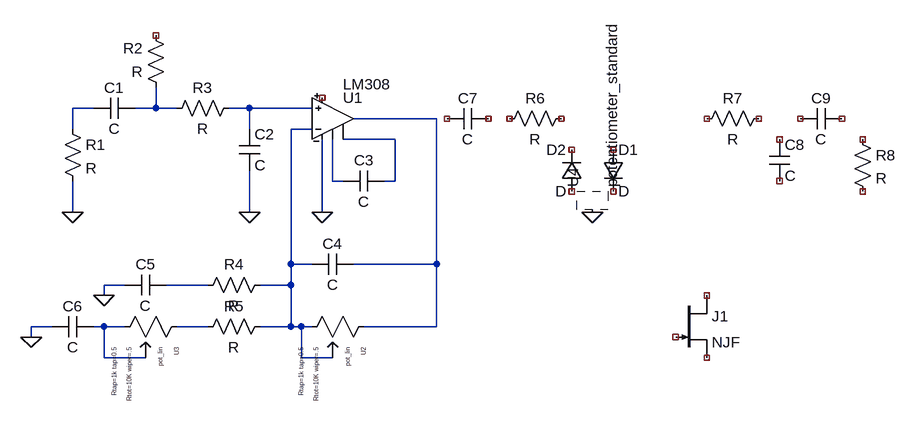
[diagram p0: schematic rat.asc]
rat.asc, the LTspice schematic file:
Version 4
SHEET 1 1336 724
WIRE 96 144 64 144
WIRE 192 144 192 112
WIRE 192 144 160 144
WIRE 224 144 192 144
WIRE 336 144 304 144
WIRE 432 144 336 144
WIRE 624 160 496 160
WIRE 64 176 64 144
WIRE 336 176 336 144
WIRE 432 176 400 176
WIRE 560 192 480 192
WIRE 464 256 464 192
WIRE 480 256 464 256
WIRE 560 256 560 192
WIRE 560 256 544 256
WIRE 64 304 64 256
WIRE 336 304 336 240
WIRE 448 304 448 192
WIRE 400 384 400 176
WIRE 432 384 400 384
WIRE 624 384 624 160
WIRE 624 384 496 384
WIRE 144 416 112 416
WIRE 272 416 208 416
WIRE 400 416 400 384
WIRE 400 416 352 416
WIRE 112 432 112 416
WIRE 32 480 0 480
WIRE 112 480 96 480
WIRE 144 480 112 480
WIRE 272 480 224 480
WIRE 400 480 400 416
WIRE 400 480 352 480
WIRE 416 480 400 480
WIRE 432 480 416 480
WIRE 624 480 624 384
WIRE 624 480 512 480
WIRE 0 496 0 480
WIRE 112 528 112 480
WIRE 176 528 112 528
WIRE 416 528 416 480
WIRE 464 528 416 528
FLAG 64 304 0
FLAG 336 304 0
FLAG 448 304 0
FLAG 112 432 0
FLAG 0 496 0
FLAG 864 304 0
SYMBOL res 48 160 R0
SYMATTR InstName R1
SYMBOL cap 160 128 R90
WINDOW 0 0 32 VBottom 2
WINDOW 3 32 32 VTop 2
SYMATTR InstName C1
SYMBOL res 208 128 R180
WINDOW 0 36 76 Left 2
WINDOW 3 36 40 Left 2
SYMATTR InstName R2
SYMBOL res 320 128 R90
WINDOW 0 0 56 VBottom 2
WINDOW 3 32 56 VTop 2
SYMATTR InstName R3
SYMBOL cap 320 176 R0
SYMATTR InstName C2
SYMBOL LM308 464 96 R0
SYMATTR InstName U1
SYMBOL cap 544 240 R90
WINDOW 0 0 32 VBottom 2
WINDOW 3 32 32 VTop 2
SYMATTR InstName C3
SYMBOL cap 496 368 R90
WINDOW 0 0 32 VBottom 2
WINDOW 3 32 32 VTop 2
SYMATTR InstName C4
SYMBOL potentiometer_standard 528 464 R90
SYMATTR InstName U2
SYMBOL res 368 400 R90
WINDOW 0 0 56 VBottom 2
WINDOW 3 32 56 VTop 2
SYMATTR InstName R4
SYMBOL res 368 464 R90
WINDOW 0 0 56 VBottom 2
WINDOW 3 32 56 VTop 2
SYMATTR InstName R5
SYMBOL potentiometer_standard 240 464 R90
SYMATTR InstName U3
SYMBOL cap 208 400 R90
WINDOW 0 0 32 VBottom 2
WINDOW 3 32 32 VTop 2
SYMATTR InstName C5
SYMBOL cap 96 464 R90
WINDOW 0 0 32 VBottom 2
WINDOW 3 32 32 VTop 2
SYMATTR InstName C6
SYMBOL cap 704 144 R90
WINDOW 0 0 32 VBottom 2
WINDOW 3 32 32 VTop 2
SYMATTR InstName C7
SYMBOL res 832 144 R90
WINDOW 0 0 56 VBottom 2
WINDOW 3 32 56 VTop 2
SYMATTR InstName R6
SYMBOL diode 880 208 R0
SYMATTR InstName D1
SYMBOL diode 848 272 R180
WINDOW 0 24 64 Left 2
WINDOW 3 24 0 Left 2
SYMATTR InstName D2
SYMBOL potentiometer_standard 896 176 R270
SYMATTR InstName U4
SYMBOL res 1136 144 R90
WINDOW 0 0 56 VBottom 2
WINDOW 3 32 56 VTop 2
SYMATTR InstName R7
SYMBOL cap 1136 192 R0
SYMATTR InstName C8
SYMBOL cap 1248 144 R90
WINDOW 0 0 32 VBottom 2
WINDOW 3 32 32 VTop 2
SYMATTR InstName C9
SYMBOL res 1264 176 R0
SYMATTR InstName R8
SYMBOL njf 992 432 R0
SYMATTR InstName J1

The netlist it stands for:
* rat.asc
R1 N001 0 R
C1 N002 N001 C
R2 N002 NC_01 R
R3 N003 N002 R
C2 N003 0 C
XU1 N003 N005 NC_02 0 N004 N007 N006 LM308  ; pins +IN -IN V+ V- OUT CA CB
C3 N006 N007 C
C4 N004 N005 C
XU2 N004 N005 N005 pot_lin Rtot=10K wiper=.5 Rtap=1k tap=0.5  ; pins A B C
R4 N005 N008 R
R5 N005 N010 R
XU3 N010 N009 N009 pot_lin Rtot=10K wiper=.5 Rtap=1k tap=0.5  ; pins A B C
C5 N008 0 C
C6 N009 0 C
C7 NC_03 NC_04 C
R6 NC_05 NC_06 R
D1 NC_07 NC_08 D
D2 NC_09 NC_10 D
* U4: potentiometer_standard (symbol potentiometer_standard not available, pin order unknown); nets seen at it: 0
R7 NC_11 NC_12 R
C8 NC_13 NC_14 C
C9 NC_15 NC_16 C
R8 NC_17 NC_18 R
J1 NC_19 NC_20 NC_21 NJF
.model D D
.lib standard.dio
.model NJF NJF
.model PJF PJF
.lib standard.jft
.lib LM308.lib
.backanno
.end